# Altium project OpenRex_V1I1.PrjPcb (part 13 of 13)
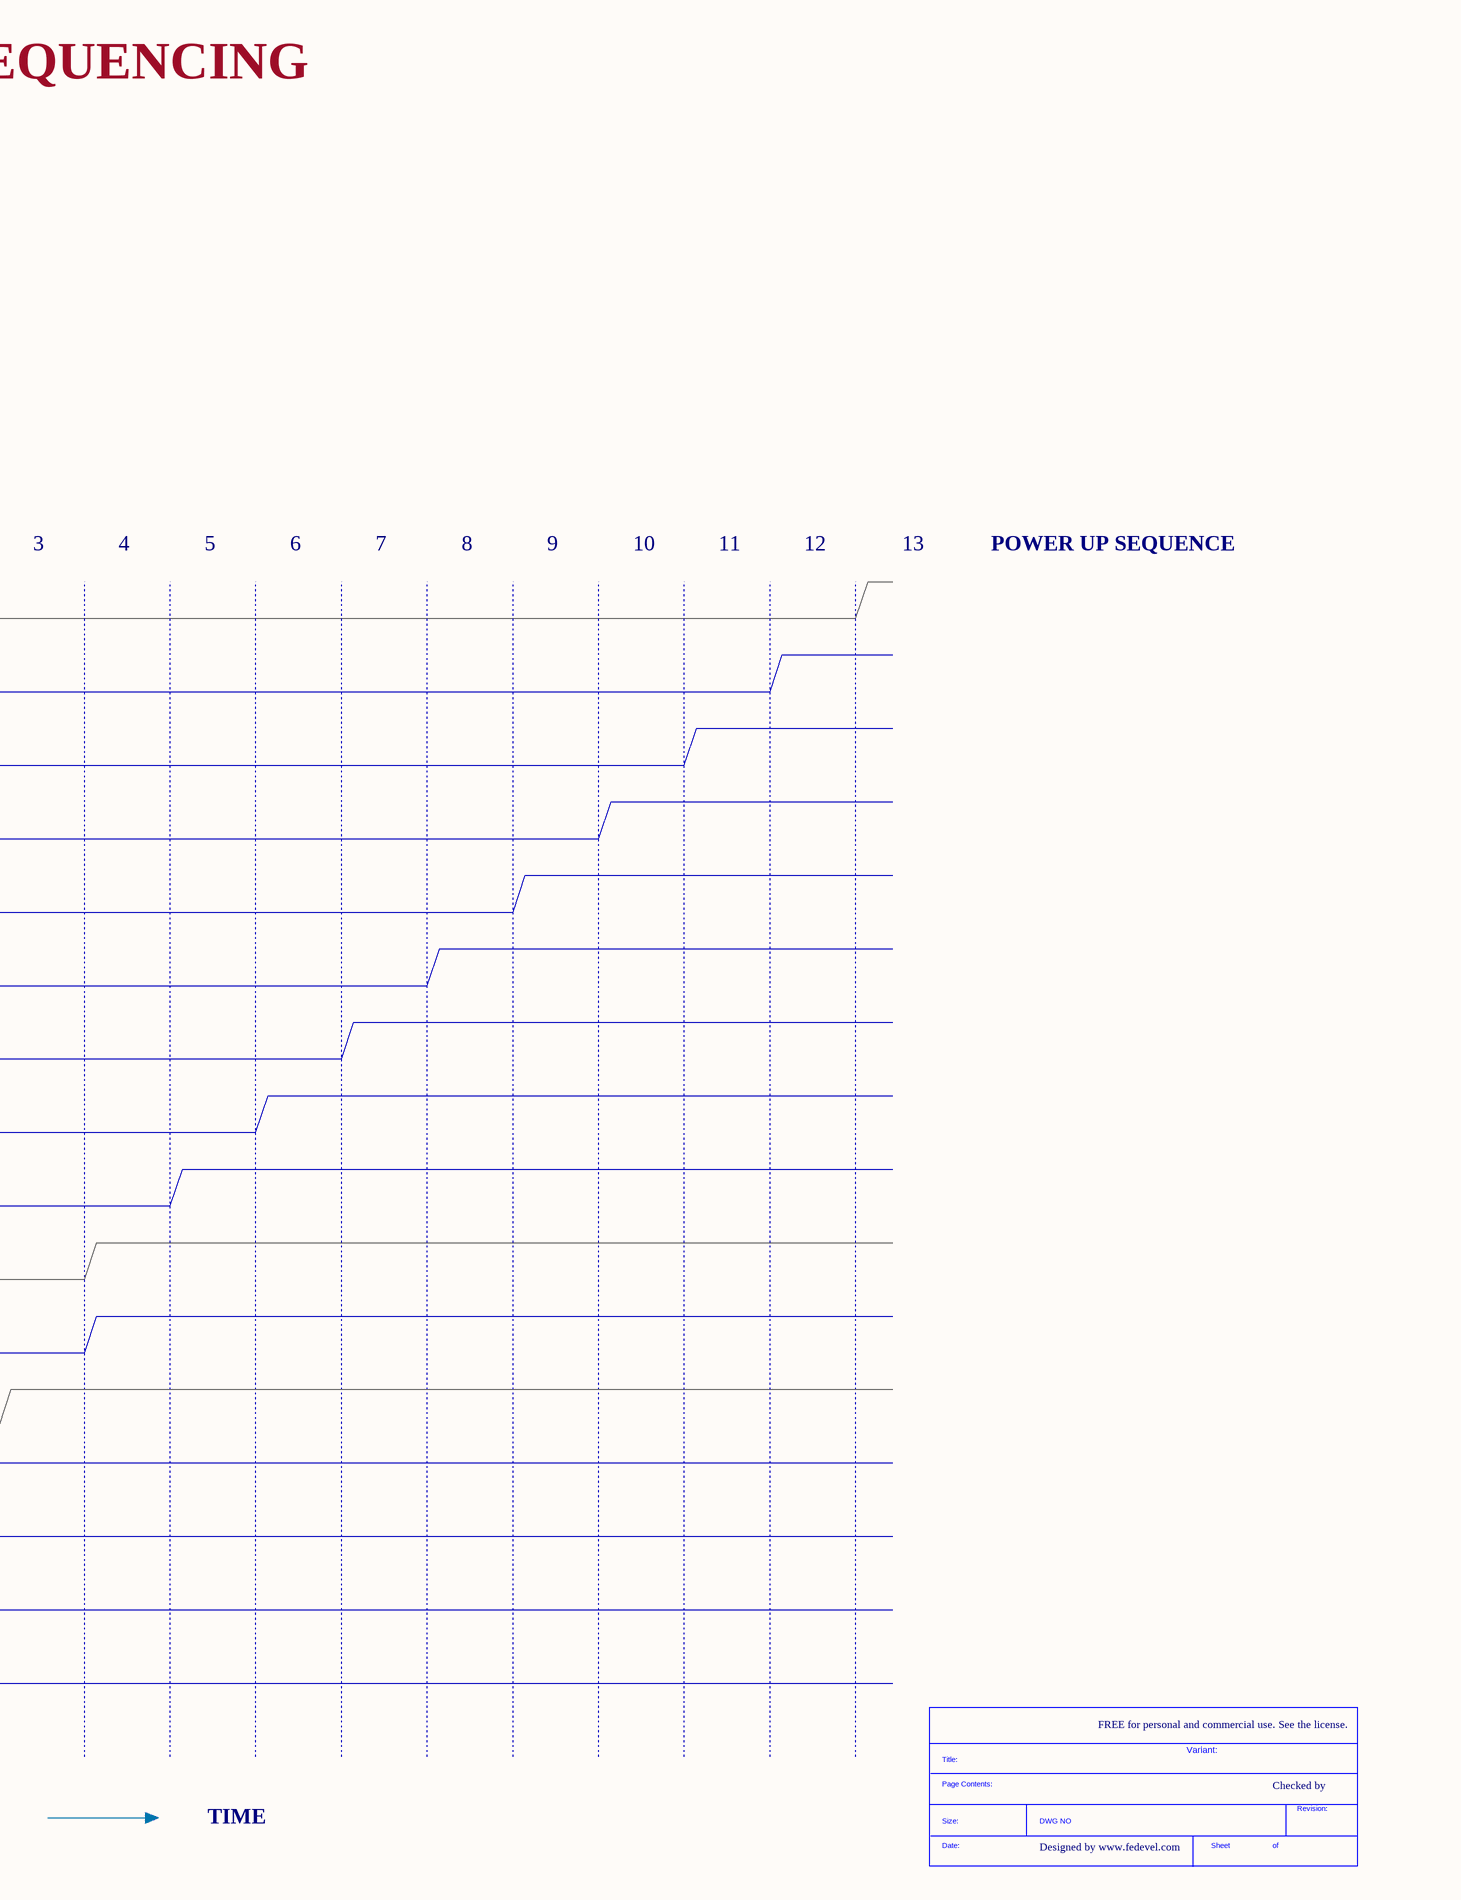
[diagram p51: [29] - POWER SEQUENCING.SchDoc, right]

## Nets that join several sheets
+1V1_VDDSOC_CAP: [04] - CPU - PCIE, USB (C78.1 FB1.1 R13.1), [05] - CPU - HDMI, LVDS (C246.1 R27.1), [06] - CPU - ETHERNET, SATA (R18.1), [12] - CPU - POWER (16 pins)
+1V2_PMIC: [15] - ETHERNET PHY (R353.2), [26] - PWR PMIC (C333.1 TP33.1 U9.18)
+1V5_DDR: [11] - CPU - JTAG, CONTROL (R302.2), [12] - CPU - POWER (13 pins), [18] - PCIE MINI (FB10.2), [26] - PWR PMIC (10 pins), [21] - AUDIO (FB20.1)
+1V8_AUDIO: [26] - PWR PMIC (C334.1 TP34.1 U9.26), [21] - AUDIO (FB11.2 FB26.2)
+1V375_CORE: [12] - CPU - POWER (28 pins), [15] - ETHERNET PHY (FB8.1), [26] - PWR PMIC (7 pins), [27] - PWR 1V375 OPT, 3V3 OPT (R340.2)
+1V375_SOC: [12] - CPU - POWER (21 pins), [26] - PWR PMIC (6 pins), [27] - PWR 1V375 OPT, 3V3 OPT (5 pins)
+2V5: [04] - CPU - PCIE, USB (C244.1 R14.1), [05] - CPU - HDMI, LVDS (C247.1 R29.1 R36.1), [06] - CPU - ETHERNET, SATA (C209.1 R19.1), [12] - CPU - POWER (C153.1 R74.2 R78.2 R80.2), [15] - ETHERNET PHY (FB6.1), [26] - PWR PMIC (C336.1 TP35.1 U9.28)
+3V0_ALWAYS: [11] - CPU - JTAG, CONTROL (14 pins), [12] - CPU - POWER (6 pins), [26] - PWR PMIC (5 pins), [27] - PWR 1V375 OPT, 3V3 OPT (R405.2)
+3V0_VSNVS: [25] - LEDS, BUTTONS (R347.2), [26] - PWR PMIC (C343.1 R262.2 R385.2 U9.43)
+3V3: [17] - LVDS, CSI, LCD, TSC (FB14.1 FB16.1), [04] - CPU - PCIE, USB (R116.2 R260.2), [05] - CPU - HDMI, LVDS (R21.2 R118.2), [08] - CPU - SPI, UART (R319.2), [10] - CPU - GPIO, PWM, LEDS, BUTTONS (6 pins), [09] - CPU - SD, AUDIO, I2C, CAN (10 pins), [11] - CPU - JTAG, CONTROL (13 pins), [12] - CPU - POWER (21 pins), [18] - PCIE MINI (5 pins), [15] - ETHERNET PHY (FB7.1 R355.1), [19] - USB (FB19.1 R198.2), [14] - MCU (6 pins), [20] - ETHERNET, SATA (C273.1 J6.14 J6.16), [25] - LEDS, BUTTONS (16 pins), [26] - PWR PMIC (13 pins), [22] - SD CARD, SPI, FLASH, EEPROM, (20 pins), [23] - SENSORS, CAN, IR (14 pins), [16] - HDMI (5 pins), [21] - AUDIO (C280.1 FB12.1 FB13.2), [24] - HEADERS, UART (13 pins)
+3V3_HDR: [27] - PWR 1V375 OPT, 3V3 OPT (7 pins), [24] - HEADERS, UART (D38.2 FB39.2 FB40.2)
+3V3_LDO: [14] - MCU (FB29.1), [26] - PWR PMIC (C337.1 TP36.1 U9.39)
+3V3_MCU: [14] - MCU (14 pins), [25] - LEDS, BUTTONS (R380.2)
+5V: [04] - CPU - PCIE, USB (C73.1 C75.1 U1.D10 U1.E9), [18] - PCIE MINI (FB17.1), [19] - USB (C237.1 FB38.1 R215.1), [26] - PWR PMIC (6 pins), [23] - SENSORS, CAN, IR (FB44.1), [16] - HDMI (C213.1 U12.1), [24] - HEADERS, UART (FB32.2 FB35.2)
+5V_USB_OTG: [19] - USB (5 pins), [28] - PWR IN, MECH, DOC (FB2.2 Q2.3)
+VIN_4V2: [15] - ETHERNET PHY (R354.1), [26] - PWR PMIC (32 pins), [27] - PWR 1V375 OPT, 3V3 OPT (15 pins), [28] - PWR IN, MECH, DOC (C381.1 D9.1 TP38.1), [24] - HEADERS, UART (R203.2)
+VIN_5V: [18] - PCIE MINI (FB37.1), [19] - USB (C252.1 FB23.1 FB24.2 U17.7), [28] - PWR IN, MECH, DOC (8 pins), [24] - HEADERS, UART (FB31.2 FB34.2 R365.2)
GND: [17] - LVDS, CSI, LCD, TSC (26 pins), [04] - CPU - PCIE, USB (13 pins), [05] - CPU - HDMI, LVDS (10 pins), [06] - CPU - ETHERNET, SATA (C81.2 C82.2 C209.2 R99.1), [11] - CPU - JTAG, CONTROL (28 pins), [12] - CPU - POWER (194 pins), [18] - PCIE MINI (42 pins), [15] - ETHERNET PHY (41 pins), [19] - USB (52 pins), [07] - CPU - CSI, DISP (R160.1), [14] - MCU (23 pins), [20] - ETHERNET, SATA (12 pins), [25] - LEDS, BUTTONS (15 pins), [26] - PWR PMIC (66 pins), [27] - PWR 1V375 OPT, 3V3 OPT (29 pins), [28] - PWR IN, MECH, DOC (16 pins), [22] - SD CARD, SPI, FLASH, EEPROM, (18 pins), [23] - SENSORS, CAN, IR (56 pins), [16] - HDMI (28 pins), [21] - AUDIO (23 pins), [24] - HEADERS, UART (32 pins)
+PWRON_1V375_OPT: [26] - PWR PMIC (C331.1 U9.16), [27] - PWR 1V375 OPT, 3V3 OPT (R341.2)
ANALOG_IN_0: [14] - MCU (R282.2 U25.1), [24] - HEADERS, UART (J1.17)
ANALOG_IN_1: [14] - MCU (U6.26), [24] - HEADERS, UART (J1.18)
ANALOG_IN_2: [14] - MCU (U6.20), [24] - HEADERS, UART (J1.19)
ANALOG_IN_3: [14] - MCU (U6.27), [24] - HEADERS, UART (J1.20 R203.1 R239.2 R365.1)
AUD3_CLK: [09] - CPU - SD, AUDIO, I2C, CAN (R206.2), [21] - AUDIO (U14.21)
AUD3_RXD: [09] - CPU - SD, AUDIO, I2C, CAN (U1.N3), [21] - AUDIO (U14.25)
AUD3_TXC: [09] - CPU - SD, AUDIO, I2C, CAN (R124.2), [21] - AUDIO (U14.24)
AUD3_TXD: [09] - CPU - SD, AUDIO, I2C, CAN (U1.P2), [21] - AUDIO (U14.26)
AUD3_TXFS: [09] - CPU - SD, AUDIO, I2C, CAN (U1.N4), [21] - AUDIO (U14.23)
CAN_N: [23] - SENSORS, CAN, IR (C312.1 R117.2 R249.1 U19.6), [24] - HEADERS, UART (J1.8)
CAN_P: [23] - SENSORS, CAN, IR (C311.1 R41.2 R246.2 U19.7), [24] - HEADERS, UART (J1.9)
COMP_INT: [10] - CPU - GPIO, PWM, LEDS, BUTTONS (R240.1 U1.N25), [23] - SENSORS, CAN, IR (R241.2 R242.2)
CPU_GPIO0: [10] - CPU - GPIO, PWM, LEDS, BUTTONS (U1.B17), [14] - MCU (R227.2), [24] - HEADERS, UART (J1.11 R208.1 R210.2)
CPU_GPIO1: [10] - CPU - GPIO, PWM, LEDS, BUTTONS (U1.B16), [14] - MCU (R228.2), [24] - HEADERS, UART (J1.12 R209.1 R211.2)
CPU_GPIO2: [10] - CPU - GPIO, PWM, LEDS, BUTTONS (U1.E23), [14] - MCU (R273.2), [24] - HEADERS, UART (J1.13)
CSI_CLK0_N: [17] - LVDS, CSI, LCD, TSC (R125.1), [07] - CPU - CSI, DISP (U1.F4)
CSI_CLK0_P: [17] - LVDS, CSI, LCD, TSC (R127.1), [07] - CPU - CSI, DISP (U1.F3)
CSI_D0_N: [17] - LVDS, CSI, LCD, TSC (R33.1), [07] - CPU - CSI, DISP (U1.E4)
CSI_D0_P: [17] - LVDS, CSI, LCD, TSC (R71.1), [07] - CPU - CSI, DISP (U1.E3)
CSI_D1_N: [17] - LVDS, CSI, LCD, TSC (R120.1), [07] - CPU - CSI, DISP (U1.D1)
CSI_D1_P: [17] - LVDS, CSI, LCD, TSC (R122.1), [07] - CPU - CSI, DISP (U1.D2)
CSI_GPIO0: [17] - LVDS, CSI, LCD, TSC (R129.1), [10] - CPU - GPIO, PWM, LEDS, BUTTONS (U1.A15)
CSI_GPIO1: [17] - LVDS, CSI, LCD, TSC (R136.1), [10] - CPU - GPIO, PWM, LEDS, BUTTONS (U1.B15)
CSPI1_CLK: [08] - CPU - SPI, UART (R43.2), [24] - HEADERS, UART (J2.23)
CSPI1_CS0: [08] - CPU - SPI, UART (U1.E22), [24] - HEADERS, UART (J2.24)
CSPI1_CS1: [08] - CPU - SPI, UART (U1.T22), [24] - HEADERS, UART (J2.26)
CSPI1_MISO: [08] - CPU - SPI, UART (U1.F21), [24] - HEADERS, UART (J2.21)
CSPI1_MOSI: [08] - CPU - SPI, UART (U1.D24), [24] - HEADERS, UART (J2.19)
CSPI2_CLK: [08] - CPU - SPI, UART (R130.2), [24] - HEADERS, UART (J2.38)
CSPI2_CS0: [08] - CPU - SPI, UART (U1.V25), [24] - HEADERS, UART (J2.35)
CSPI2_MISO: [08] - CPU - SPI, UART (U1.U24), [24] - HEADERS, UART (J2.40)
CSPI2_MOSI: [08] - CPU - SPI, UART (U1.T21), [24] - HEADERS, UART (J2.37)
CSPI3_CLK: [08] - CPU - SPI, UART (R131.2), [22] - SD CARD, SPI, FLASH, EEPROM, (R361.2 TP24.1 U15.6 U34.4)
CSPI3_CS0: [08] - CPU - SPI, UART (U1.P21), [22] - SD CARD, SPI, FLASH, EEPROM, (R364.2 TP25.1 U34.7)
CSPI3_CS2: [08] - CPU - SPI, UART (U1.R25), [22] - SD CARD, SPI, FLASH, EEPROM, (TP28.1 U15.1)
CSPI3_MCU_CLK: [14] - MCU (U6.19), [22] - SD CARD, SPI, FLASH, EEPROM, (R361.1 U34.13)
CSPI3_MCU_CS0: [14] - MCU (U6.8), [22] - SD CARD, SPI, FLASH, EEPROM, (R364.1 U34.10)
CSPI3_MCU_ENn: [08] - CPU - SPI, UART (R319.1 U1.M25), [22] - SD CARD, SPI, FLASH, EEPROM, (U34.14 U34.15)
CSPI3_MCU_MISO: [14] - MCU (U6.17), [22] - SD CARD, SPI, FLASH, EEPROM, (R363.1 U34.6)
CSPI3_MCU_MOSI: [14] - MCU (U6.18), [22] - SD CARD, SPI, FLASH, EEPROM, (R362.1 U34.12)
CSPI3_MISO: [08] - CPU - SPI, UART (U1.P23), [22] - SD CARD, SPI, FLASH, EEPROM, (R363.2 TP23.1 U15.2 U34.11)
CSPI3_MOSI: [08] - CPU - SPI, UART (U1.P22), [22] - SD CARD, SPI, FLASH, EEPROM, (R362.2 TP22.1 U15.5 U34.5)
ENET_LED_LINK: [15] - ETHERNET PHY (R81.2), [20] - ETHERNET, SATA (J6.13)
ENET_LED_RX: [15] - ETHERNET PHY (R82.2), [20] - ETHERNET, SATA (R287.2 R288.2)
ENET_REF_CLK: [06] - CPU - ETHERNET, SATA (U1.V22), [15] - ETHERNET PHY (R181.2)
FLEXCAN1_RX: [09] - CPU - SD, AUDIO, I2C, CAN (U1.D14), [23] - SENSORS, CAN, IR (R412.1 U20.4)
FLEXCAN1_STBY: [09] - CPU - SD, AUDIO, I2C, CAN (R280.1 U1.D15), [23] - SENSORS, CAN, IR (Q13.1 R413.1)
FLEXCAN1_TX: [09] - CPU - SD, AUDIO, I2C, CAN (U1.B13), [23] - SENSORS, CAN, IR (R411.1 U35.1 U35.2)
FLEXCAN2_RX: [09] - CPU - SD, AUDIO, I2C, CAN (U1.F14), [24] - HEADERS, UART (J2.16)
FLEXCAN2_TX: [09] - CPU - SD, AUDIO, I2C, CAN (U1.E14), [24] - HEADERS, UART (J2.15)
GPIO_OR_CLK: [10] - CPU - GPIO, PWM, LEDS, BUTTONS (U1.A17), [24] - HEADERS, UART (J2.7)
GPIO_OR_PWM_1: [10] - CPU - GPIO, PWM, LEDS, BUTTONS (U1.R22), [24] - HEADERS, UART (J2.29)
GPIO_OR_PWM_2: [10] - CPU - GPIO, PWM, LEDS, BUTTONS (U1.T25), [24] - HEADERS, UART (R368.1 R369.1)
GPIO_OR_PWM_3: [10] - CPU - GPIO, PWM, LEDS, BUTTONS (U1.B19), [24] - HEADERS, UART (J2.32)
GPIO_OR_PWM_4: [10] - CPU - GPIO, PWM, LEDS, BUTTONS (U1.F17), [24] - HEADERS, UART (J2.33)
GYRO_INT: [10] - CPU - GPIO, PWM, LEDS, BUTTONS (R410.1 U1.N24), [23] - SENSORS, CAN, IR (R313.2 R314.2)
HDMI_CEC_IN: [05] - CPU - HDMI, LVDS (R24.2 R25.2 R118.1), [16] - HDMI (U12.16)
HDMI_CLK_N: [05] - CPU - HDMI, LVDS (U1.J5), [16] - HDMI (J5.12 U12.15 U12.24)
HDMI_CLK_P: [05] - CPU - HDMI, LVDS (U1.J6), [16] - HDMI (J5.10 U12.13 U12.26)
HDMI_D0_N: [05] - CPU - HDMI, LVDS (U1.K5), [16] - HDMI (J5.9 U12.12 U12.27)
HDMI_D0_P: [05] - CPU - HDMI, LVDS (U1.K6), [16] - HDMI (J5.7 U12.10 U12.29)
HDMI_D1_N: [05] - CPU - HDMI, LVDS (U1.J3), [16] - HDMI (J5.6 U12.9 U12.30)
HDMI_D1_P: [05] - CPU - HDMI, LVDS (U1.J4), [16] - HDMI (J5.4 U12.7 U12.32)
HDMI_D2_N: [05] - CPU - HDMI, LVDS (U1.K3), [16] - HDMI (J5.3 U12.6 U12.33)
HDMI_D2_P: [05] - CPU - HDMI, LVDS (U1.K4), [16] - HDMI (J5.1 U12.4 U12.35)
HDMI_HPD: [05] - CPU - HDMI, LVDS (R23.2), [16] - HDMI (R357.2 U33.4)
I2C1_SCL: [09] - CPU - SD, AUDIO, I2C, CAN (R132.1 U1.H20), [26] - PWR PMIC (R238.1), [22] - SD CARD, SPI, FLASH, EEPROM, (U18.6), [23] - SENSORS, CAN, IR (U22.4 U28.11), [24] - HEADERS, UART (R278.1)
I2C1_SCL_MCU: [14] - MCU (R291.1 U6.10), [24] - HEADERS, UART (R279.1)
I2C1_SDA: [09] - CPU - SD, AUDIO, I2C, CAN (R28.1 U1.G23), [26] - PWR PMIC (R247.1), [22] - SD CARD, SPI, FLASH, EEPROM, (U18.5), [23] - SENSORS, CAN, IR (U22.6 U28.12), [24] - HEADERS, UART (R276.1)
I2C1_SDA_MCU: [14] - MCU (R290.1 U6.11), [24] - HEADERS, UART (R277.1)
I2C2_SCL: [17] - LVDS, CSI, LCD, TSC (R154.1), [09] - CPU - SD, AUDIO, I2C, CAN (R134.1 U1.U5), [18] - PCIE MINI (J15.30), [23] - SENSORS, CAN, IR (U24.1 U26.6), [16] - HDMI (U12.17), [21] - AUDIO (U14.29), [24] - HEADERS, UART (J2.28)
I2C2_SDA: [17] - LVDS, CSI, LCD, TSC (R156.1), [09] - CPU - SD, AUDIO, I2C, CAN (R133.1 U1.T7), [18] - PCIE MINI (J15.32), [23] - SENSORS, CAN, IR (U24.6 U26.1), [16] - HDMI (U12.18), [21] - AUDIO (U14.27), [24] - HEADERS, UART (J2.27)
I2C3_SCL: [17] - LVDS, CSI, LCD, TSC (R196.2), [09] - CPU - SD, AUDIO, I2C, CAN (R142.1 U1.R4), [24] - HEADERS, UART (J2.5)
I2C3_SDA: [17] - LVDS, CSI, LCD, TSC (R195.2), [09] - CPU - SD, AUDIO, I2C, CAN (R137.1 U1.R2), [24] - HEADERS, UART (J2.3)
IR_RCV: [10] - CPU - GPIO, PWM, LEDS, BUTTONS (U1.A20), [23] - SENSORS, CAN, IR (U23.1)
LVDS0_CLK_N: [17] - LVDS, CSI, LCD, TSC (R135.1), [05] - CPU - HDMI, LVDS (U1.V4)
LVDS0_CLK_P: [17] - LVDS, CSI, LCD, TSC (R138.1), [05] - CPU - HDMI, LVDS (U1.V3)
LVDS0_TX0_N: [17] - LVDS, CSI, LCD, TSC (R65.1), [05] - CPU - HDMI, LVDS (U1.U2)
LVDS0_TX0_P: [17] - LVDS, CSI, LCD, TSC (R119.1), [05] - CPU - HDMI, LVDS (U1.U1)
LVDS0_TX1_N: [17] - LVDS, CSI, LCD, TSC (R121.1), [05] - CPU - HDMI, LVDS (U1.U4)
LVDS0_TX1_P: [17] - LVDS, CSI, LCD, TSC (R123.1), [05] - CPU - HDMI, LVDS (U1.U3)
LVDS0_TX2_N: [17] - LVDS, CSI, LCD, TSC (R126.1), [05] - CPU - HDMI, LVDS (U1.V2)
LVDS0_TX2_P: [17] - LVDS, CSI, LCD, TSC (R128.1), [05] - CPU - HDMI, LVDS (U1.V1)
LVDS0_TX3_N: [17] - LVDS, CSI, LCD, TSC (TP19.1), [05] - CPU - HDMI, LVDS (U1.W2)
LVDS0_TX3_P: [17] - LVDS, CSI, LCD, TSC (TP20.1), [05] - CPU - HDMI, LVDS (U1.W1)
MCU_BTN: [14] - MCU (R390.2), [25] - LEDS, BUTTONS (C314.1 D35.1 R149.1)
MCU_ISPn: [10] - CPU - GPIO, PWM, LEDS, BUTTONS (R213.1 U1.B21), [14] - MCU (R204.2)
MCU_RSTINn: [10] - CPU - GPIO, PWM, LEDS, BUTTONS (R212.1 U1.A21), [14] - MCU (U21.1 U21.2)
MCU_RSTOUTn: [11] - CPU - JTAG, CONTROL (R93.1), [14] - MCU (U6.16)
MCU_SWDIO: [10] - CPU - GPIO, PWM, LEDS, BUTTONS (TP31.1 U1.P1), [14] - MCU (U25.3)
MCU_SWDIO_SEL: [10] - CPU - GPIO, PWM, LEDS, BUTTONS (R289.1 U1.N2), [14] - MCU (U25.6)
PCIE_CLK_N: [04] - CPU - PCIE, USB (C66.2 R17.2), [18] - PCIE MINI (J15.11)
PCIE_CLK_P: [04] - CPU - PCIE, USB (C67.2 R16.2), [18] - PCIE MINI (J15.13)
PCIE_RSTn: [11] - CPU - JTAG, CONTROL (R158.2 R170.1), [18] - PCIE MINI (J15.22)
PCIE_RSTn_R: [04] - CPU - PCIE, USB (U1.V5), [11] - CPU - JTAG, CONTROL (R170.2)
PCIE_RX_N: [04] - CPU - PCIE, USB (U1.B1), [18] - PCIE MINI (J15.23)
PCIE_RX_P: [04] - CPU - PCIE, USB (U1.B2), [18] - PCIE MINI (J15.25)
PCIE_TX_N: [04] - CPU - PCIE, USB (C63.2), [18] - PCIE MINI (J15.31)
PCIE_TX_P: [04] - CPU - PCIE, USB (C65.2), [18] - PCIE MINI (J15.33)
PCIE_WAKE: [04] - CPU - PCIE, USB (U1.P3), [18] - PCIE MINI (J15.1 R197.1)
PCIE_WDISn: [04] - CPU - PCIE, USB (R116.1 U1.R1), [18] - PCIE MINI (J15.20)
PMIC_INT: [11] - CPU - JTAG, CONTROL (U1.T24), [26] - PWR PMIC (R236.2 R263.1 U9.1)
PMIC_STBY_REQ: [11] - CPU - JTAG, CONTROL (D28.2), [14] - MCU (D36.2), [26] - PWR PMIC (R237.2 R385.1 U9.4)
POK_1V375_OPT: [11] - CPU - JTAG, CONTROL (R351.1), [27] - PWR 1V375 OPT, 3V3 OPT (U30.3)
POK_3V3_OPT: [11] - CPU - JTAG, CONTROL (R333.1), [27] - PWR 1V375 OPT, 3V3 OPT (R405.1 U36.3)
POK_PMIC: [11] - CPU - JTAG, CONTROL (R177.1), [26] - PWR PMIC (R229.1 U9.3), [27] - PWR 1V375 OPT, 3V3 OPT (R404.2)
POK_SYS: [11] - CPU - JTAG, CONTROL (5 pins), [15] - ETHERNET PHY (U32.9), [25] - LEDS, BUTTONS (Q4.1)
PWRON: [11] - CPU - JTAG, CONTROL (D29.2), [25] - LEDS, BUTTONS (D39.2), [26] - PWR PMIC (R262.1 TP6.1 U9.56)
RGMII_INT: [06] - CPU - ETHERNET, SATA (R88.2 U1.W22), [15] - ETHERNET PHY (R89.1 TP27.1 U7.38)
RGMII_MDC: [06] - CPU - ETHERNET, SATA (U1.V20), [15] - ETHERNET PHY (R85.1 R87.1)
RGMII_MDIO: [06] - CPU - ETHERNET, SATA (U1.V23), [15] - ETHERNET PHY (R86.1 R162.1)
RGMII_RSTn: [11] - CPU - JTAG, CONTROL (D10.2 R180.1), [15] - ETHERNET PHY (R75.1 U7.42)
RGMII_RXCLK: [06] - CPU - ETHERNET, SATA (U1.B25), [15] - ETHERNET PHY (R83.1)
RGMII_RXD0: [06] - CPU - ETHERNET, SATA (U1.C24), [15] - ETHERNET PHY (R98.1 U7.32)
RGMII_RXD1: [06] - CPU - ETHERNET, SATA (U1.B23), [15] - ETHERNET PHY (R97.1 U7.31)
RGMII_RXD2: [06] - CPU - ETHERNET, SATA (U1.B24), [15] - ETHERNET PHY (R96.1 U7.28)
RGMII_RXD3: [06] - CPU - ETHERNET, SATA (U1.D23), [15] - ETHERNET PHY (R95.1 U7.27)
RGMII_RXDV: [06] - CPU - ETHERNET, SATA (U1.D22), [15] - ETHERNET PHY (R91.1 U7.33)
RGMII_TXCLK: [06] - CPU - ETHERNET, SATA (R35.2), [15] - ETHERNET PHY (U7.24)
RGMII_TXD0: [06] - CPU - ETHERNET, SATA (U1.C22), [15] - ETHERNET PHY (U7.19)
RGMII_TXD1: [06] - CPU - ETHERNET, SATA (U1.F20), [15] - ETHERNET PHY (U7.20)
RGMII_TXD2: [06] - CPU - ETHERNET, SATA (U1.E21), [15] - ETHERNET PHY (U7.21)
RGMII_TXD3: [06] - CPU - ETHERNET, SATA (U1.A24), [15] - ETHERNET PHY (U7.22)
RGMII_TXEN: [06] - CPU - ETHERNET, SATA (U1.C23), [15] - ETHERNET PHY (U7.25)
RST_BTN_HDR: [25] - LEDS, BUTTONS (5 pins), [24] - HEADERS, UART (J1.15)
RSTINn: [11] - CPU - JTAG, CONTROL (R68.1 U8.1), [25] - LEDS, BUTTONS (R348.2)
RSTOUTn: [11] - CPU - JTAG, CONTROL (R144.2 U11.4), [19] - USB (R218.2), [14] - MCU (R281.2), [28] - PWR IN, MECH, DOC (R155.2), [23] - SENSORS, CAN, IR (R318.1 U29.2), [24] - HEADERS, UART (J1.14)
SATA_RX_N: [06] - CPU - ETHERNET, SATA (C69.2), [20] - ETHERNET, SATA (J8.5)
SATA_RX_P: [06] - CPU - ETHERNET, SATA (C70.2), [20] - ETHERNET, SATA (J8.6)
SATA_TX_N: [06] - CPU - ETHERNET, SATA (C71.2), [20] - ETHERNET, SATA (J8.3)
SATA_TX_P: [06] - CPU - ETHERNET, SATA (C72.2), [20] - ETHERNET, SATA (J8.2)
SD2_ACT: [09] - CPU - SD, AUDIO, I2C, CAN (U1.T3), [22] - SD CARD, SPI, FLASH, EEPROM, (Q6.1)
SD2_CD: [09] - CPU - SD, AUDIO, I2C, CAN (R150.1 U1.R6), [22] - SD CARD, SPI, FLASH, EEPROM, (Q3.3)
SD2_CLK: [09] - CPU - SD, AUDIO, I2C, CAN (R153.2), [22] - SD CARD, SPI, FLASH, EEPROM, (J13.5)
SD2_CMD: [09] - CPU - SD, AUDIO, I2C, CAN (R143.1 R152.2), [22] - SD CARD, SPI, FLASH, EEPROM, (J13.3)
SD2_DATA0: [09] - CPU - SD, AUDIO, I2C, CAN (U1.A22), [22] - SD CARD, SPI, FLASH, EEPROM, (J13.7)
SD2_DATA1: [09] - CPU - SD, AUDIO, I2C, CAN (U1.E20), [22] - SD CARD, SPI, FLASH, EEPROM, (J13.8)
SD2_DATA2: [09] - CPU - SD, AUDIO, I2C, CAN (U1.A23), [22] - SD CARD, SPI, FLASH, EEPROM, (J13.1)
SD2_DATA3: [09] - CPU - SD, AUDIO, I2C, CAN (U1.B22), [22] - SD CARD, SPI, FLASH, EEPROM, (J13.2)
SD2_WP: [09] - CPU - SD, AUDIO, I2C, CAN (R151.1 U1.T1), [22] - SD CARD, SPI, FLASH, EEPROM, (R139.2)
TEMP_ALERT: [10] - CPU - GPIO, PWM, LEDS, BUTTONS (R257.1 U1.E24), [23] - SENSORS, CAN, IR (U24.3)
TRD0_N: [15] - ETHERNET PHY (U7.3), [20] - ETHERNET, SATA (J6.10)
TRD0_P: [15] - ETHERNET PHY (U7.2), [20] - ETHERNET, SATA (J6.11)
TRD1_N: [15] - ETHERNET PHY (U7.6), [20] - ETHERNET, SATA (J6.5)
TRD1_P: [15] - ETHERNET PHY (U7.5), [20] - ETHERNET, SATA (J6.4)
TRD2_N: [15] - ETHERNET PHY (U7.8), [20] - ETHERNET, SATA (J6.2)
TRD2_P: [15] - ETHERNET PHY (U7.7), [20] - ETHERNET, SATA (J6.3)
TRD3_N: [15] - ETHERNET PHY (U7.11), [20] - ETHERNET, SATA (J6.9)
TRD3_P: [15] - ETHERNET PHY (U7.10), [20] - ETHERNET, SATA (J6.8)
TS_X+: [17] - LVDS, CSI, LCD, TSC (D37.5 J10.1), [14] - MCU (C177.1 FB15.2)
TS_X-: [17] - LVDS, CSI, LCD, TSC (D37.1 J10.2), [14] - MCU (C178.1 FB25.2)
TS_Y+: [17] - LVDS, CSI, LCD, TSC (D37.4 J10.4), [14] - MCU (C210.1 FB28.2)
TS_Y-: [17] - LVDS, CSI, LCD, TSC (D37.3 J10.3), [14] - MCU (C179.1 FB27.2)
UART1_CTS: [08] - CPU - SPI, UART (U1.G21), [24] - HEADERS, UART (Q8.4 R60.1 R375.1)
UART1_RTS: [08] - CPU - SPI, UART (U1.G20), [24] - HEADERS, UART (Q11.1 R376.1 R378.1)
UART1_RXD: [08] - CPU - SPI, UART (U1.M3), [24] - HEADERS, UART (Q8.1 R370.1 R373.1)
UART1_TXD: [08] - CPU - SPI, UART (U1.M1), [24] - HEADERS, UART (Q11.4 R371.1 R374.1)
UART2_RXD: [08] - CPU - SPI, UART (U1.D13), [14] - MCU (TP30.1 U6.32)
UART2_TXD: [08] - CPU - SPI, UART (U1.C13), [14] - MCU (TP29.1 U6.31)
UART3_CTS: [08] - CPU - SPI, UART (U1.D25), [24] - HEADERS, UART (J2.36)
UART3_RTS: [08] - CPU - SPI, UART (U1.F23), [24] - HEADERS, UART (J2.11)
UART3_RXD: [08] - CPU - SPI, UART (U1.G22), [24] - HEADERS, UART (J2.10)
UART3_TXD: [08] - CPU - SPI, UART (U1.F22), [24] - HEADERS, UART (J2.8)
UART4_RXD: [08] - CPU - SPI, UART (U1.V6), [24] - HEADERS, UART (J2.13)
UART4_TXD: [08] - CPU - SPI, UART (U1.W5), [24] - HEADERS, UART (R366.1 R367.1)
UART5_RXD: [08] - CPU - SPI, UART (U1.U6), [24] - HEADERS, UART (J2.18)
UART5_TXD: [08] - CPU - SPI, UART (U1.U7), [24] - HEADERS, UART (J2.22)
USB0_ID: [04] - CPU - PCIE, USB (U1.T4), [19] - USB (D19.1 J11.4 R198.1 R199.2), [28] - PWR IN, MECH, DOC (U16.2)
USB0_ID_BUFF_EN: [04] - CPU - PCIE, USB (R305.2 U1.H21), [28] - PWR IN, MECH, DOC (R304.2)
USB0_N: [04] - CPU - PCIE, USB (U1.B6), [19] - USB (R322.2 R323.2)
USB0_P: [04] - CPU - PCIE, USB (U1.A6), [19] - USB (R325.2 R326.2)
USB1_N: [04] - CPU - PCIE, USB (U1.F10), [19] - USB (R328.2 R329.2)
USB1_P: [04] - CPU - PCIE, USB (U1.E10), [19] - USB (R331.2 R332.2)
USB_HDR_N: [19] - USB (R194.2 R207.1), [24] - HEADERS, UART (L7.3)
USB_HDR_P: [19] - USB (R297.2 R298.1), [24] - HEADERS, UART (L7.4)
USB_MCU_N: [19] - USB (R207.2 R294.2), [14] - MCU (R299.2)
USB_MCU_P: [19] - USB (R295.1 R298.2), [14] - MCU (R300.2 R387.2)
USB_MPCIE_N: [18] - PCIE MINI (L6.4), [19] - USB (U13.8)
USB_MPCIE_P: [18] - PCIE MINI (L6.3), [19] - USB (U13.9)
USER_BTN_1: [10] - CPU - GPIO, PWM, LEDS, BUTTONS (U1.C15), [25] - LEDS, BUTTONS (D35.2 R381.1)
USER_BTN_2: [10] - CPU - GPIO, PWM, LEDS, BUTTONS (U1.A16), [25] - LEDS, BUTTONS (C315.1 R254.1)
USER_BTN_3: [10] - CPU - GPIO, PWM, LEDS, BUTTONS (U1.E15), [25] - LEDS, BUTTONS (C316.1 R255.1)
USER_LED: [11] - CPU - JTAG, CONTROL (U1.E19), [25] - LEDS, BUTTONS (Q12.1)
USER_LED_1: [10] - CPU - GPIO, PWM, LEDS, BUTTONS (U1.A18), [14] - MCU (U6.30), [25] - LEDS, BUTTONS (R145.2)
USER_LED_2: [10] - CPU - GPIO, PWM, LEDS, BUTTONS (U1.C17), [14] - MCU (R389.2), [25] - LEDS, BUTTONS (R165.2)
USER_LED_3: [10] - CPU - GPIO, PWM, LEDS, BUTTONS (U1.F16), [14] - MCU (R391.2), [25] - LEDS, BUTTONS (R176.2)
USER_LED_4: [10] - CPU - GPIO, PWM, LEDS, BUTTONS (U1.D17), [14] - MCU (R392.2), [25] - LEDS, BUTTONS (R189.2)
USER_LED_5: [10] - CPU - GPIO, PWM, LEDS, BUTTONS (U1.A19), [25] - LEDS, BUTTONS (R192.2)
USER_LED_6: [10] - CPU - GPIO, PWM, LEDS, BUTTONS (U1.B18), [25] - LEDS, BUTTONS (R193.2)
USER_LED_7: [10] - CPU - GPIO, PWM, LEDS, BUTTONS (U1.E17), [25] - LEDS, BUTTONS (R200.2)
USER_LED_8: [10] - CPU - GPIO, PWM, LEDS, BUTTONS (U1.C18), [25] - LEDS, BUTTONS (R202.2)
VID_IN_CSI1_D0: [17] - LVDS, CSI, LCD, TSC (J7.9), [07] - CPU - CSI, DISP (U1.M21)
VID_IN_CSI1_D1: [17] - LVDS, CSI, LCD, TSC (J7.10), [07] - CPU - CSI, DISP (U1.L24)
VID_IN_CSI1_D2: [17] - LVDS, CSI, LCD, TSC (J7.11), [07] - CPU - CSI, DISP (U1.L25)
VID_IN_CSI1_D3: [17] - LVDS, CSI, LCD, TSC (J7.12), [07] - CPU - CSI, DISP (U1.K25)
VID_IN_CSI1_D4: [17] - LVDS, CSI, LCD, TSC (J7.14), [07] - CPU - CSI, DISP (U1.L23)
VID_IN_CSI1_D5: [17] - LVDS, CSI, LCD, TSC (J7.15), [07] - CPU - CSI, DISP (U1.L22)
VID_IN_CSI1_D6: [17] - LVDS, CSI, LCD, TSC (J7.16), [07] - CPU - CSI, DISP (U1.K24)
VID_IN_CSI1_D7: [17] - LVDS, CSI, LCD, TSC (J7.17), [07] - CPU - CSI, DISP (U1.L21)
VID_IN_CSI1_D8: [17] - LVDS, CSI, LCD, TSC (J7.19), [07] - CPU - CSI, DISP (U1.J25)
VID_IN_CSI1_D9: [17] - LVDS, CSI, LCD, TSC (J7.20), [07] - CPU - CSI, DISP (U1.L20)
VID_IN_CSI1_D10: [17] - LVDS, CSI, LCD, TSC (J7.21), [07] - CPU - CSI, DISP (U1.K23)
VID_IN_CSI1_D11: [17] - LVDS, CSI, LCD, TSC (J7.22), [07] - CPU - CSI, DISP (U1.K21)
VID_IN_CSI1_D12: [17] - LVDS, CSI, LCD, TSC (J7.24), [07] - CPU - CSI, DISP (U1.G24)
VID_IN_CSI1_D13: [17] - LVDS, CSI, LCD, TSC (J7.25), [07] - CPU - CSI, DISP (U1.J22)
VID_IN_CSI1_D14: [17] - LVDS, CSI, LCD, TSC (J7.26), [07] - CPU - CSI, DISP (U1.G25)
VID_IN_CSI1_D15: [17] - LVDS, CSI, LCD, TSC (J7.27), [07] - CPU - CSI, DISP (U1.H22)
VID_IN_CSI1_D16: [17] - LVDS, CSI, LCD, TSC (J7.29), [07] - CPU - CSI, DISP (U1.H23)
VID_IN_CSI1_D17: [17] - LVDS, CSI, LCD, TSC (J7.30), [07] - CPU - CSI, DISP (U1.F24)
VID_IN_CSI1_D18: [17] - LVDS, CSI, LCD, TSC (J7.31), [07] - CPU - CSI, DISP (U1.J21)
VID_IN_CSI1_D19: [17] - LVDS, CSI, LCD, TSC (J7.32), [07] - CPU - CSI, DISP (U1.F25)
VID_IN_CSI1_DE: [17] - LVDS, CSI, LCD, TSC (J7.34), [07] - CPU - CSI, DISP (U1.M22)
VID_IN_CSI1_HSYNC: [17] - LVDS, CSI, LCD, TSC (J7.6), [07] - CPU - CSI, DISP (U1.M20)
VID_IN_CSI1_INT: [17] - LVDS, CSI, LCD, TSC (J7.35), [07] - CPU - CSI, DISP (U1.K22)
VID_IN_CSI1_INT2: [17] - LVDS, CSI, LCD, TSC (J7.36), [07] - CPU - CSI, DISP (U1.M23)
VID_IN_CSI1_PIXCLK: [17] - LVDS, CSI, LCD, TSC (R275.1), [07] - CPU - CSI, DISP (U1.H25)
VID_IN_CSI1_RSTn: [17] - LVDS, CSI, LCD, TSC (J7.37), [11] - CPU - JTAG, CONTROL (R178.1 R179.1)
VID_IN_CSI1_RSTn_R: [11] - CPU - JTAG, CONTROL (R179.2), [07] - CPU - CSI, DISP (U1.N22)
VID_IN_CSI1_VSYNC: [17] - LVDS, CSI, LCD, TSC (J7.7), [07] - CPU - CSI, DISP (U1.M24)

## Assembly variants
Production: not fitted C177 C178 C179 C210 C237 C252 C263 C264 C327 C328 C390 C391 C392 C393 C406 C407 C408 C409 C410 C411 C416 C417 C418 C432 C433 D4 D8 D28 D29 D30 D31 D32 D36 D38 D39 FB2 FB8 FB17 FB20 FB26 FB29 FB32 FB35 FB38 FB41 FB42 FB43 L12 LINK1 LINK2 Q14 R15 R21 R24 R41 R52 R53 R54 R57 R58 R60 R65 R67 R68 R70 R87 R93 R104 R110 R114 R117 R119 R121 R123 R126 R128 R135 R138 R147 R148 R158 R159 R167 R168 R171 R174 R177 R178 R182 R191 R197 R199 R203 R207 R208 R209 R210 R211 R215 R216 R217 R234 R236 R239 R245 R250 R258 R261 R266 R271 R272 R274 R281 R282 R287 R290 R291 R294 R295 R298 R304 R310 R313 R316 R322 R325 R328 R331 R334 R335 R336 R337 R338 R339 R340 R341 R342 R343 R344 R347 R350 R352 R355 R357 R359 R360 R365 R367 R368 R371 R373 R374 R376 R378 R383 R385 R386 R387 R388 R392 R393 R394 R395 R396 R400 R401 R403 R408 R411 R412 R413 U17 U30 U34